# EAGLE design untitled (EAGLE 5.08)
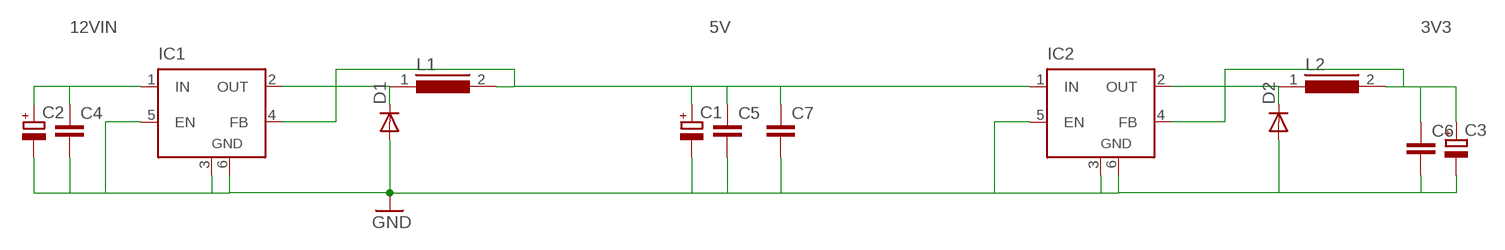
[diagram p0: schematic, sheet 1]

## Parts
C1  CPOL-EU175TMP-0810  [175TMP-0810]
C2  CPOL-EU175TMP-0810  [175TMP-0810]
C3  CPOL-EU175TMP-0810  [175TMP-0810]
C4  C-EUC0805K  [C0805K]
C5  C-EUC0805K  [C0805K]
C6  C-EUC0805K  [C0805K]
C7  C-EUC0805K  [C0805K]
D1  DIODE-SMC  [SMC]
D2  DIODE-SMC  [SMC]
IC1  LM2596S  [TO263-5]
IC2  LM2596S  [TO263-5]
L1  DR125  [DR125]
L2  DR125  [DR125]

## Nets
3V3: C3.+ C6.1 IC2.4(FB) L2.2
5V: C1.+ C5.1 C7.1 IC1.4(FB) IC2.1(IN) L1.2
12VIN: C2.+ C4.1 IC1.1(IN)
GND: C1.- C2.- C3.- C4.2 C5.2 C6.2 C7.2 D1.A D2.A IC1.3(GND) IC1.5(EN) IC1.6(GND) IC2.3(GND) IC2.5(EN) IC2.6(GND)
N$1: D1.C IC1.2(OUT) L1.1
N$5: D2.C IC2.2(OUT) L2.1

## Library data of the parts
C1-C3 = rcl:CPOL-EU: POLARIZED CAPACITOR, European symbol
C4-C7 = rcl:C-EU: CAPACITOR, European symbol
D1 D2 = diode:DIODE-: DIODE
IC1 IC2 = linear:LM2596S: STEP-DOWN VOLTAGE REGULATOR
L1 L2 = inductors:DR125: High Power Density, High Efficiency, Shielded Inductors Source: coiltronics_dr_series.pdf

## Board
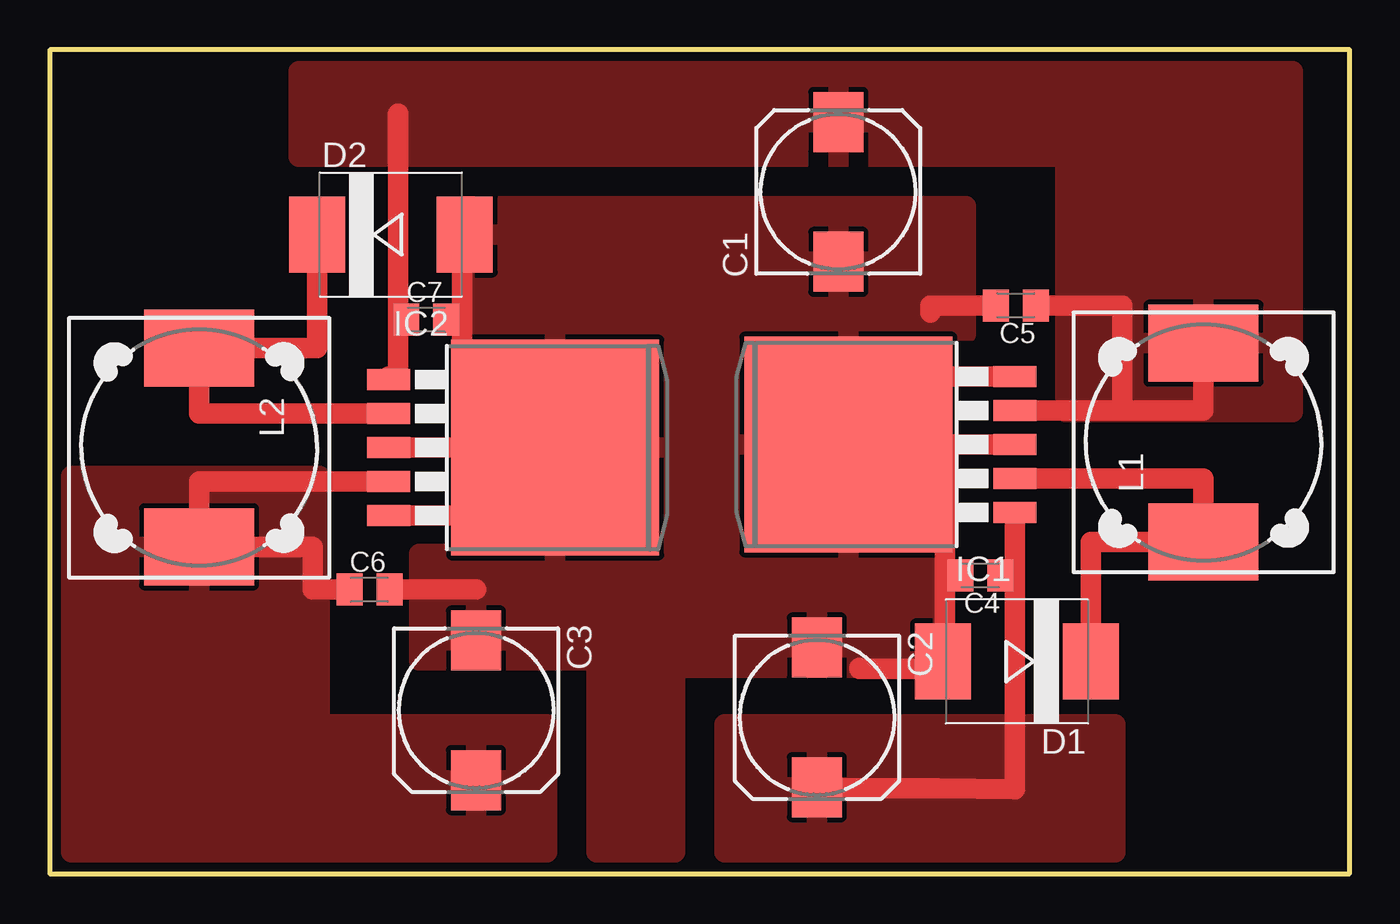
[diagram p1: board, top side]

Size 65.07 x 41.25 mm. Coordinates in mm from the lower left corner, seen from the top.
Outline: 0,0 65.08,0 65.08,41.25 0,41.25 0,0
Copper layers (1*16): Top 0.018mm / dielectric 1mm / Bottom 0.018mm
Design rules "default *": minimum track width 0.15mm, minimum drill 0.3mm, track to track 0.2mm, track to pad 0.2mm, pad to pad 0.16mm, via to via 0.16mm, smd to smd 0.16mm, copper to edge 0.25mm, drill to drill 0.25mm, minimum pad ring 25mil, minimum via ring 12mil, stop-mask expansion 4mil, vias tented up to drill 0mil, thermal gap 10mil

### Footprints (pad centres in the part's own frame; a part is rotated, then mirrored left to right if it is on the bottom)
175TMP-0810 = smd 3 x 2.5: + 3.5,0; - -3.5,0
C0805K = smd 1.3 x 1.6: 1 -1,0; 2 1,0
SMC = smd 2.8 x 3.8: A 3.7,0; C -3.7,0
TO263-5 = smd 1.067 x 2.159: 1 -3.404,-5.791; 2 -1.702,-5.791; 3 0,-5.791; 4 1.702,-5.791; 5 3.404,-5.791 | smd 10.8 x 10.41: 6 0,2.54
DR125 = smd 3.85 x 5.5: 1 -4.975,0; 2 4.975,0

### Placement (x,y rotation side)
C1  39.47,34.14 90 top
C2  38.4,7.82 270 top
C3  21.34,8.18 270 top
C4  46.58,14.94 180 top
C5  48.36,28.45 180 top
C6  16,14.22 0 top
C7  18.85,27.74 0 top
D1  48.41,10.62 180 top
D2  17.07,32 0 top
IC1  42.52,21.49 90 top
IC2  22.76,21.34 270 top
L1  57.76,21.59 90 top
L2  7.47,21.34 270 top

### Tracks (layer width: path | path; a pad name or v marks a point on that pad's centre or on a via)
3V3
  Top 1.016: L2.2 7.47,19.63 IC2.4 | L2.2 9.65,16.36 | C6.1 13.16,14.22 13.16,16.36 L2.2
  pour Top: 24.89,7.47 13.51,7.47 13.51,19.91 1.07,19.91 1.07,1.07 24.89,1.07
5V
  Top 1.016: 53.7,23.19 57.76,23.19 L1.2 58.32,26.57 | IC1.4 53.7,23.19 | IC2.1 16.71,24.74 | C5.1 53.7,28.45 53.7,23.19 | IC2.1 17.07,24.74 | IC2.1 16.97,24.89 17.42,24.89 17.42,28.09 | 17.42,28.09 17.42,38.05 | 17.42,28.09 C7.1
  pour Top: 50.85,23.11 50.85,35.92 12.45,35.92 12.45,40.18 62.23,40.18 62.23,23.11
12VIN
  Top 1.016: C2.+ 38.46,4.27 44.45,4.27 48.31,4.22 48.31,14.94 | 48.31,14.94 IC1.1 | 48.31,14.94 C4.1
  pour Top: 33.78,7.47 33.78,1.07 53.34,1.07 53.34,7.47
GND
  Top 1.016: 44.81,10.26 D1.A | 44.81,14.94 44.81,21.34 42.33,21.41 | 44.81,10.26 44.81,14.94 | 42.33,21.41 IC1.6 | 42.33,21.49 IC1.3 | 42.33,21.41 42.33,21.49 | 42.33,24.89 IC1.5 | 42.33,21.49 42.33,24.89 | D2.A 20.62,32.36 20.62,28.09 | 20.62,21.34 20.62,28.09 | 23.11,21.34 20.62,21.34 | 23.11,21.34 IC2.6 25.25,21.34 | 20.62,21.34 IC2.3 | IC2.5 22.76,17.93 22.76,18.49 23.11,18.49 23.11,21.34 | 42.33,24.89 42.33,25.25 39.83,25.25 | C5.2 44.09,28.45 44.09,28.09 | 44.81,10.26 40.54,10.26 40.54,10.31 | C6.2 21.34,14.22 | 44.81,14.94 C4.2 | 20.62,28.09 C7.2
  pour Top: 27.38,1.07 27.38,10.67 18.49,10.67 18.49,16 20.62,16 20.62,33.43 45.87,33.43 45.87,27.03 44.81,27.03 44.81,10.31 31.29,10.31 31.29,1.07
N$1
  Top 1.016: IC1.2 57.76,19.79 L1.1 52.11,16.61 D1.C
N$5
  Top 1.016: IC2.2 7.47,23.04 L2.1 13.37,26.31 D2.C

### Text on the board
Document: GND
tDocu: +5v | +3.3v | +12v